# Altium schematic sheet Breadboard_Pot.SchDoc
size 114 x 76 mm
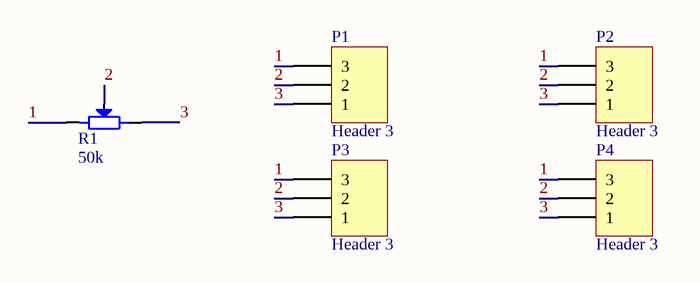
[diagram p0: Breadboard_Pot.SchDoc]

## Parts
P1  Header 3  [HDR1X3]
P2  Header 3  [HDR1X3]
P3  Header 3  [HDR1X3]
P4  Header 3  [HDR1X3]
R1  50k  [RV09]

## Nets
1: P1.3 P2.3 P3.3 P4.3 R1.1
2: P1.2 P2.2 P3.2 P4.2 R1.2(W)
3: P1.1 P2.1 P3.1 P4.1 R1.3

## Library data of the parts
P1-P4 = Header 3: Header, 3-Pin; LatestRevisionDate: 17-Jul-2002; LatestRevisionNote: Re-released for DXP Platform.; Publisher: Altium Limited
R1 = POT